# EAGLE design as7805 (EAGLE 5.11)
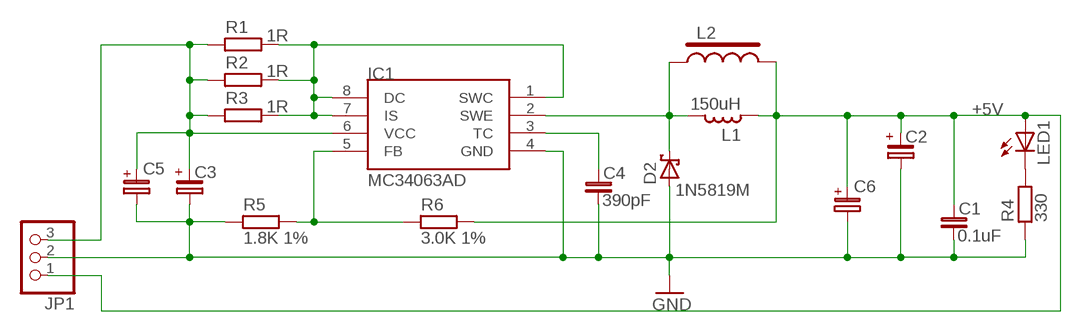
[diagram p0: schematic, sheet 1]

## Parts
C1  0.1uF  C_0603  [C0603]
C2  CP_SMCC  [SMC_C]
C3  CP_SMCC  [SMC_C]
C4  390pF  C_0603  [C0603]
C5  CP_E-035X080  [CE-035X080]
C6  CP_E-035X080  [CE-035X080]
D2  1N5819M  SCHOTTKY-MELF  [MELF-MLL41]
IC1  MC34063AD  [SOIC8]
JP1  PINHD-1X3_2.54-90°  [1X03/90]
L1  150uH  L_L4040  [L4040]
L2  L-RCH895  [RCH895]
LED1  LEDCHIP-LED0805  [CHIP-LED0805]
R1  1R  R_0805  [R0805]
R2  1R  R_0805  [R0805]
R3  1R  R_0805  [R0805]
R4  330  R_0603  [R0603]
R5  1.8K 1%  R_0603  [R0603]
R6  3.0K 1%  R_0603  [R0603]

## Nets
+5V: C1.1 C2.+ C6.+ JP1.1 L1.2 L2.2 LED1.A R6.2
GND: C1.2 C2.- C3.- C4.2 C5.- C6.- D2.A IC1.4(GND) JP1.2 R4.1 R5.1
N$1: C4.1 IC1.3(TC)
N$2: D2.C IC1.2(SWE) L1.1 L2.1
N$3: LED1.C R4.2
N$5: IC1.5(FB) R5.2 R6.1
N$6: IC1.1(SWC) IC1.7(IS) IC1.8(DC) R1.2 R2.2 R3.2
VPOW: C3.+ C5.+ IC1.6(VCC) JP1.3 R1.1 R2.1 R3.1

## Library data of the parts
C1 C4 = rc-master-smd:C_: NON-POLARIZED CAP
C2 C3 = rc-master-smd:CP_: POLARIZED CAP
C5 C6 = rc-master:CP_: POLARIZED CAP
D2 = rs485:SCHOTTKY-: Schottky Diode
IC1 = rs485:MC34063: 1.5 A, Step-Up/Down/Inverting Switching Regulator
JP1 = pinhead-fixdrills:PINHD-1X3: PIN HEADER
L1 = rc-master-smd:L_: INDUCTOR
L2 = discrete:L-: Inductors
LED1 = rs485:LED: LED OSRAM: - CHIPLED LG R971, LG N971, LY N971, LG Q971, LY Q971, LO R971, LY R971 LH N974, LH R974 LS Q976, LO Q976, LY Q976 LO Q996 - Hyper CHIPLED LW Q18S LB Q993, LB Q99A, LB R99A - SideLED LS A670, LO A670, LY A670, LG A670, LP A670 LB A673, LV A673, LT A673, LW A673 LH A674 LY A675 LS A676, LA A676, LO A676, LY A676, LW A676 LS A679, LY A679, LG A679 - Hyper Micro SIDELED® LS Y876, LA Y876, LO Y876, LY Y876 LT Y87S - SmartLED LW L88C, LW L88S LB L89C, LB L89S, LG L890 LS L89K, LO L89K, LY L89K LS L896, LA L896, LO L896, LY L896 - TOPLED LS T670, LO T670, LY T670, LG T670, LP T670 LSG T670, LSP T670, LSY T670, LOP T670, LYG T670 LG T671, LOG T671, LSG T671 LB T673, LV T673, LT T673, LW T673 LH T674 LS T676, LA T676, LO T676, LY T676, LB T676, LH T676, LSB T676, LW T676 LB T67C, LV T67C, LT T67C, LS T67K, LO T67K, LY T67K, LW E67C LS E67B, LA E67B, LO E67B, LY E67B, LB E67C, LV E67C, LT E67C LW T67C LS T679, LY T679, LG T679 LS T770, LO T770, LY T770, LG T770, LP T770 LB T773, LV T773, LT T773, LW T773 LH T774 LS E675, LA E675, LY E675, LS T675 LS T776, LA T776, LO T776, LY T776, LB T776 LHGB T686 LT T68C, LB T68C - Hyper Mini TOPLED® LB M676 - Mini TOPLED Santana® LG M470 LS M47K, LO M47K, LY M47K Source: http://www.osram.convergy.de - LUMILED® LXK2-PW12-R00, LXK2-PW12-S00, LXK2-PW14-U00, LXK2-PW14-V00 LXK2-PM12-R00, LXK2-PM12-S00, LXK2-PM14-U00 LXK2-PE12-Q00, LXK2-PE12-R00, LXK2-PE12-S00, LXK2-PE14-T00, LXK2-PE14-U00 LXK2-PB12-K00, LXK2-PB12-L00, LXK2-PB12-M00, LXK2-PB14-N00, LXK2-PB14-P00, LXK2-PB14-Q00 LXK2-PR12-L00, LXK2-PR12-M00, LXK2-PR14-Q00, LXK2-PR14-R00 LXK2-PD12-Q00, LXK2-PD12-R00, LXK2-PD12-S00 LXK2-PH12-R00, LXK2-PH12-S00 LXK2-PL12-P00, LXK2-PL12-Q00, LXK2-PL12-R00 Source: www.luxeon.com
R1-R6 = rc-master-smd:R_: RESISTOR

## Board
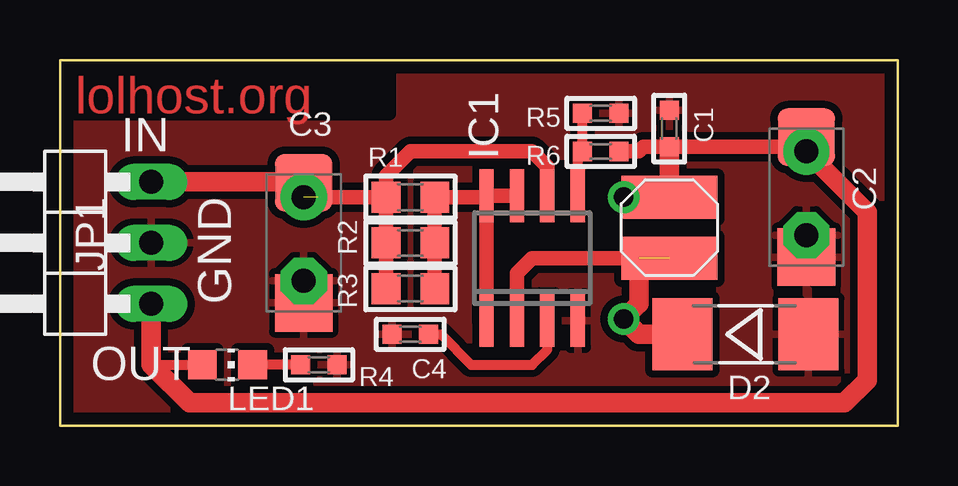
[diagram p1: board, top side]
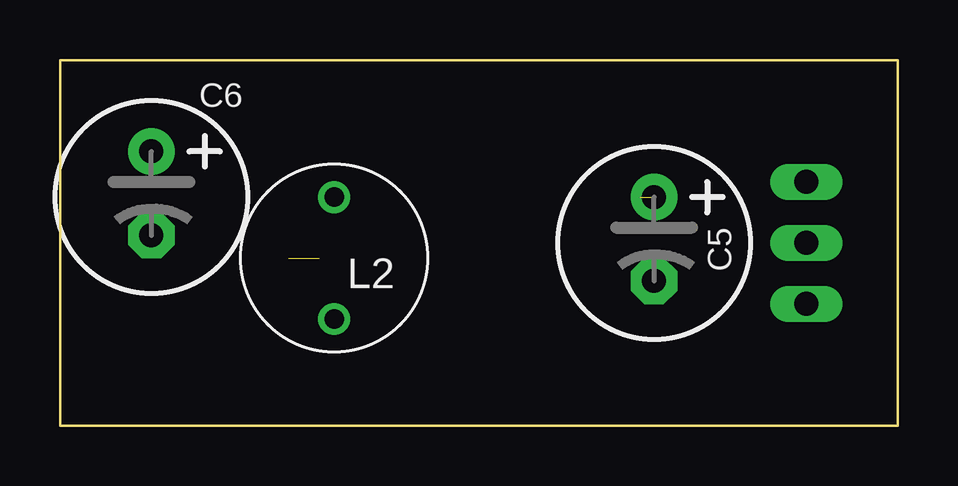
[diagram p2: board, bottom side, seen from below]

Size 34.92 x 15.24 mm. Coordinates in mm from the lower left corner, seen from the top.
Outline: 0,0 0,15.24 34.92,15.24 34.92,0 0,0
Copper layers (1*16): Top 0.035mm / dielectric 1.5mm / Bottom 0.035mm
Design rules "default *": minimum track width 10mil, minimum drill 24mil, track to track 8mil, track to pad 8mil, pad to pad 8mil, via to via 8mil, smd to smd 8mil, copper to edge 0.5mm, drill to drill 8mil, minimum pad ring 10mil, minimum via ring 8mil, stop-mask expansion 4mil, vias tented up to drill 0mil, thermal gap 10mil

### Footprints (pad centres in the part's own frame; a part is rotated, then mirrored left to right if it is on the bottom)
C0603 = smd 0.8 x 0.8: 1 -0.762,0; 2 0.762,0
SMC_C = smd 2.4 x 2.4: + -2.5,0; - 2.5,0
CE-035X080 = drill 1 pad 1.93 round: + -1.905,0 | drill 1 pad 1.93 octagon: - 1.587,0
MELF-MLL41 = smd 2.5 x 3: A 2.625,0; C -2.625,0
SOIC8 = smd 0.6 x 2.2: 1 -1.905,-2.6; 2 -0.635,-2.6; 3 0.635,-2.6; 4 1.905,-2.6; 5 1.905,2.6; 6 0.635,2.6; 7 -0.635,2.6; 8 -1.905,2.6
1X03/90 = drill 1 long: 1 -2.54,-3.81; 2 0,-3.81; 3 2.54,-3.81
L4040 = smd 1.8 x 4: 1 -1.27,0; 2 1.27,0
RCH895 = drill 0.813 round: 1 0,2.54; 2 0,-2.54
CHIP-LED0805 = smd 1.2 x 1.2: A 0,-1.05; C 0,1.05
R0805 = smd 1.2 x 1.3: 1 -1.016,0; 2 1.016,0
R0603 = smd 0.8 x 0.8: 1 -0.762,0; 2 0.762,0

### Placement (x,y rotation side)
C1  25.4,12.38 90 top
C2  31.11,9.53 270 top
C3  10.16,7.62 270 top
C4  14.61,3.81 180 top
C5  10.16,7.62 270 bottom
C6  31.11,9.53 270 bottom
D2  28.57,3.81 0 top
IC1  19.68,6.99 0 top
JP1  0,7.62 90 top
L1  25.4,8.26 90 top
L2  23.5,6.99 180 bottom
LED1  6.99,2.54 270 top
R1  14.61,9.53 0 top
R2  14.61,7.62 0 top
R3  14.61,5.71 0 top
R4  10.79,2.54 180 top
R5  22.54,13.02 180 top
R6  22.54,11.43 0 top

### Tracks (layer width: path | path; a pad name or v marks a point on that pad's centre or on a via)
+5V
  Top 0.406: C2.+ 30.52,12.03 C6.+ | L1.2 L2.2 | 3.81,2.54 LED1.A
  Top 0.61: R6.2 24.13,11.43 24.32,11.62 C1.1 30.71,11.62 C2.+
  Top 0.813: C1.1 L1.2 | JP1.1 3.81,2.54 5.4,0.95 32.7,0.95 33.66,1.91 33.66,8.89 C6.+
GND
  pour Top (isolate 0.305): -0.64,15.88 35.56,15.88 35.56,-0.64 -0.64,-0.64
N$1
  Top 0.406: C4.1 15.88,3.81 17.14,2.54 19.68,2.54 20.32,3.17 IC1.3
N$2  (1 unrouted)
  Top 0.61: IC1.2 19.05,6.35 19.68,6.99 L1.1
  Top 0.813: 24.13,6.99 24.13,5.08 L2.1 24.13,3.81 D2.C
N$3
  Top 0.406: R4.2 LED1.C
N$5
  Top 0.406: IC1.5 21.59,11.24 R6.1 R5.2
N$6
  Top 0.61: R3.2 R2.2 R1.2 17.72,9.53 IC1.8 | IC1.8 IC1.1 | IC1.8 IC1.7
VPOW  (1 unrouted)
  Top 0.406: C3.+ 10.76,9.53
  Top 0.61: IC1.6 20.32,10.79 19.68,11.43 14.61,11.43 13.59,10.41 R1.1 | R3.1 R2.1 R1.1 | 10.76,9.53 R1.1
  Top 0.813: JP1.3 10.12,10.16 C3.+

### Text on the board
Top: lolhost.org
tNames: IN | GND | OUT